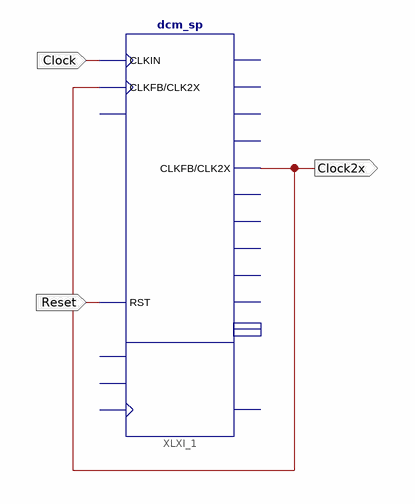
[diagram p0: schematic sheet 1]
// Xilinx ISE schematic Double_Clock.sch (spartan3e) as structural Verilog: 1 symbols, 3 ports
module Double_Clock (
  input  Clock,
  input  Reset,
  output Clock2x
);

  dcm_sp XLXI_1 (
    .CLKFB(Clock2x), .CLKIN(Clock), .RST(Reset), .CLK2X(Clock2x));  // open: DSSEN, PSCLK, PSEN, PSINCDEC, CLK0, CLK180, CLK270, CLK2X180, CLK90, CLKDV, CLKFX, CLKFX180, LOCKED, PSDONE, STATUS
endmodule
